# Altium schematic sheet button_brightness_esp32.SchDoc
size A4
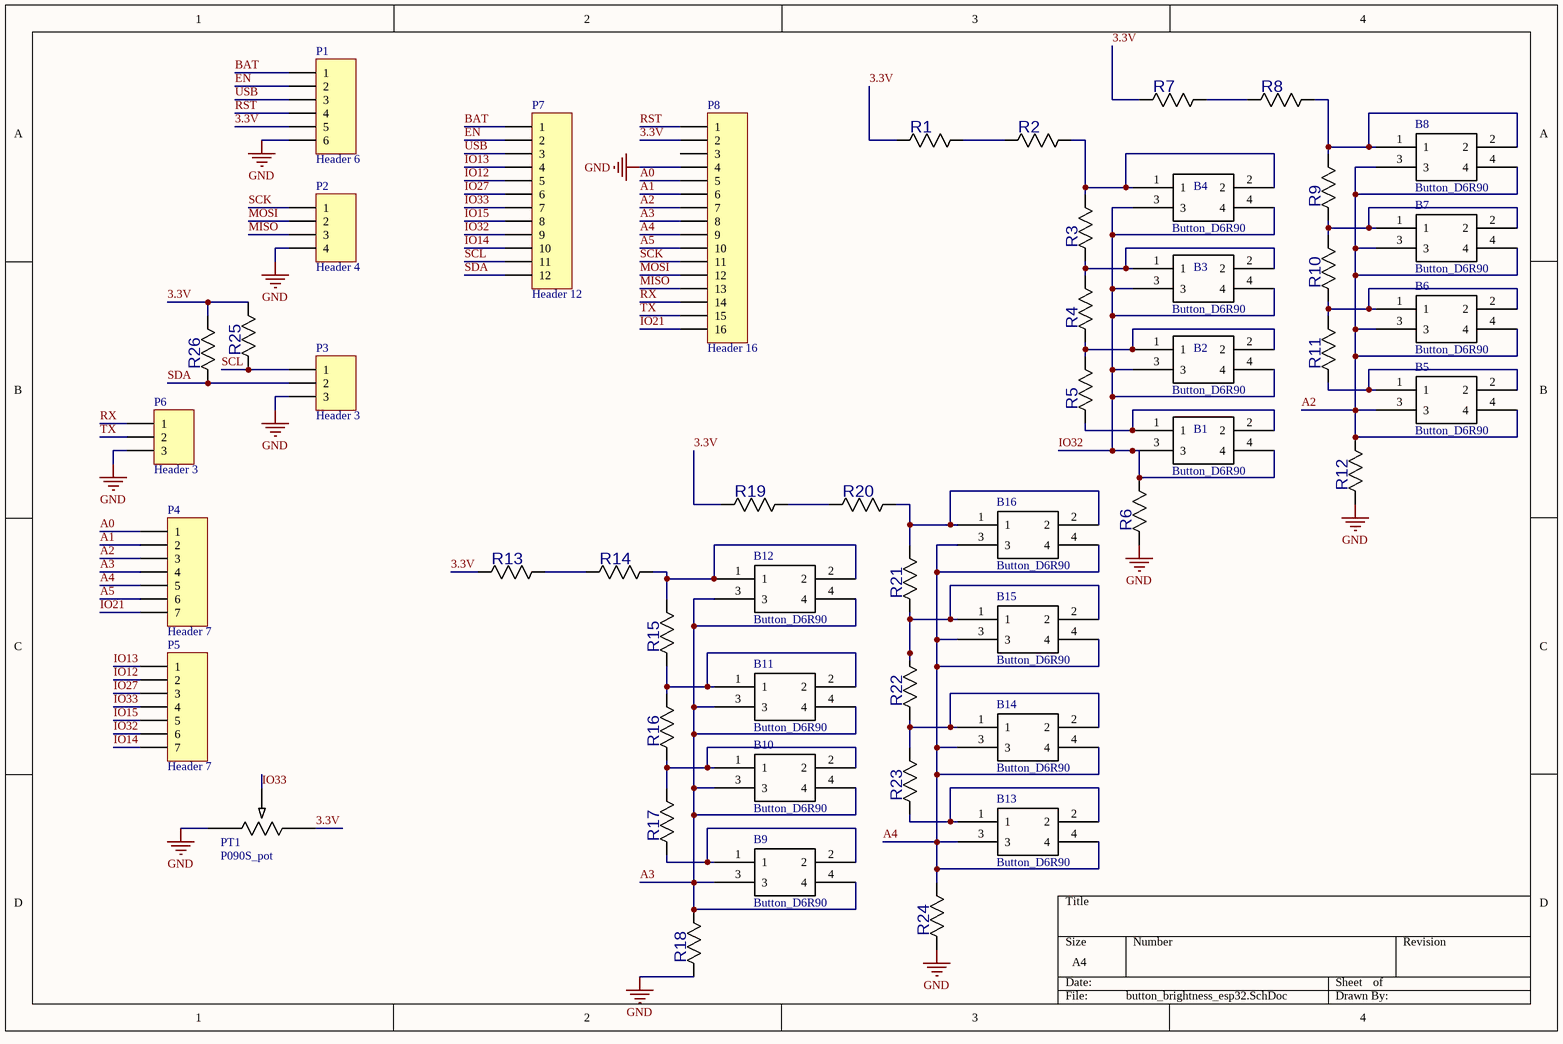
[diagram p0: button_brightness_esp32.SchDoc]

## Parts
B1  Button_D6R90  [Button_D6R90]
B2  Button_D6R90  [Button_D6R90]
B3  Button_D6R90  [Button_D6R90]
B4  Button_D6R90  [Button_D6R90]
B5  Button_D6R90  [Button_D6R90]
B6  Button_D6R90  [Button_D6R90]
B7  Button_D6R90  [Button_D6R90]
B8  Button_D6R90  [Button_D6R90]
B9  Button_D6R90  [Button_D6R90]
B10  Button_D6R90  [Button_D6R90]
B11  Button_D6R90  [Button_D6R90]
B12  Button_D6R90  [Button_D6R90]
B13  Button_D6R90  [Button_D6R90]
B14  Button_D6R90  [Button_D6R90]
B15  Button_D6R90  [Button_D6R90]
B16  Button_D6R90  [Button_D6R90]
P1  Header 6  [CONN_6]
P2  Header 4  [CONN_4]
P3  Header 3  [CONN_3]
P4  Header 7  [CONN_7]
P5  Header 7  [CONN_7]
P6  Header 3  [CONN_3]
P7  Header 12  [ESP32_feather_short_pins]
P8  Header 16  [ESP32_feather_long_pins]
PT1  P090S_pot  [POT_PTA3043]
R1  ERJ-6GEYJ471V  [RES_0804_panasonic]  (value not drawn)
R2  ERJ-6GEYJ471V  [RES_0804_panasonic]  (value not drawn)
R3  ERJ-6GEYJ471V  [RES_0804_panasonic]  (value not drawn)
R4  ERJ-6GEYJ471V  [RES_0804_panasonic]  (value not drawn)
R5  ERJ-6GEYJ471V  [RES_0804_panasonic]  (value not drawn)
R6  ERJ-6GEYJ471V  [RES_0804_panasonic]  (value not drawn)
R7  ERJ-6GEYJ471V  [RES_0804_panasonic]  (value not drawn)
R8  ERJ-6GEYJ471V  [RES_0804_panasonic]  (value not drawn)
R9  ERJ-6GEYJ471V  [RES_0804_panasonic]  (value not drawn)
R10  ERJ-6GEYJ471V  [RES_0804_panasonic]  (value not drawn)
R11  ERJ-6GEYJ471V  [RES_0804_panasonic]  (value not drawn)
R12  ERJ-6GEYJ471V  [RES_0804_panasonic]  (value not drawn)
R13  ERJ-6GEYJ471V  [RES_0804_panasonic]  (value not drawn)
R14  ERJ-6GEYJ471V  [RES_0804_panasonic]  (value not drawn)
R15  ERJ-6GEYJ471V  [RES_0804_panasonic]  (value not drawn)
R16  ERJ-6GEYJ471V  [RES_0804_panasonic]  (value not drawn)
R17  ERJ-6GEYJ471V  [RES_0804_panasonic]  (value not drawn)
R18  ERJ-6GEYJ471V  [RES_0804_panasonic]  (value not drawn)
R19  ERJ-6GEYJ471V  [RES_0804_panasonic]  (value not drawn)
R20  ERJ-6GEYJ471V  [RES_0804_panasonic]  (value not drawn)
R21  ERJ-6GEYJ471V  [RES_0804_panasonic]  (value not drawn)
R22  ERJ-6GEYJ471V  [RES_0804_panasonic]  (value not drawn)
R23  ERJ-6GEYJ471V  [RES_0804_panasonic]  (value not drawn)
R24  ERJ-6GEYJ471V  [RES_0804_panasonic]  (value not drawn)
R25  ERJ-6GEYJ471V  [RES_0804_panasonic]  (value not drawn)
R26  ERJ-6GEYJ471V  [RES_0804_panasonic]  (value not drawn)

## Nets
GND: P1.6 P2.4 P3.3 P6.3 P8.4 PT1.1 R6.2 R12.2 R18.2 R24.2
3.3V: P1.5 P8.2 PT1.3 R1.2 R7.2 R13.2 R19.2 R25.1 R26.1
A0: P4.1 P8.5
A1: P4.2 P8.6
A2: B5.3 B5.4 B6.3 B6.4 B7.3 B7.4 B8.3 B8.4 P4.3 P8.7 R12.1
A3: B9.3 B9.4 B10.3 B10.4 B11.3 B11.4 B12.3 B12.4 P4.4 P8.8 R18.1
A4: B13.3 B13.4 B14.3 B14.4 B15.3 B15.4 B16.3 B16.4 P4.5 P8.9 R24.1
A5: P4.6 P8.10
BAT: P1.1 P7.1
EN: P1.2 P7.2
IO12: P5.2 P7.5
IO13: P5.1 P7.4
IO14: P5.7 P7.10
IO15: P5.5 P7.8
IO21: P4.7 P8.16
IO27: P5.3 P7.6
IO32: B1.3 B1.4 B2.3 B2.4 B3.3 B3.4 B4.3 B4.4 P5.6 P7.9 R6.1
IO33: P5.4 P7.7 PT1.2
MISO: P2.3 P8.13
MOSI: P2.2 P8.12
RST: P1.4 P8.1
RX: P6.1 P8.14
SCK: P2.1 P8.11
SCL: P3.1 P7.11 R25.2
SDA: P3.2 P7.12 R26.2
TX: P6.2 P8.15
USB: P1.3 P7.3
NetB1_1: B1.1 B1.2 R5.2
NetB2_1: B2.1 B2.2 R4.2 R5.1
NetB3_1: B3.1 B3.2 R3.2 R4.1
NetB4_1: B4.1 B4.2 R2.1 R3.1
NetB5_1: B5.1 B5.2 R11.2
NetB6_1: B6.1 B6.2 R10.2 R11.1
NetB7_1: B7.1 B7.2 R9.2 R10.1
NetB8_1: B8.1 B8.2 R8.1 R9.1
NetB9_1: B9.1 B9.2 R17.2
NetB10_1: B10.1 B10.2 R16.2 R17.1
NetB11_1: B11.1 B11.2 R15.2 R16.1
NetB12_1: B12.1 B12.2 R14.1 R15.1
NetB13_1: B13.1 B13.2 R23.2
NetB14_1: B14.1 B14.2 R22.2 R23.1
NetB15_1: B15.1 B15.2 R21.2 R22.1
NetB16_1: B16.1 B16.2 R20.1 R21.1
NetR1_1: R1.1 R2.2
NetR7_1: R7.1 R8.2
NetR13_1: R13.1 R14.2
NetR19_1: R19.1 R20.2

Not connected (* = marked no-connect by the designer): P8 3

## Library data of the parts
P1 = Header 6: Header, 6-Pin; LatestRevisionDate: 17-Jul-2002; LatestRevisionNote: Re-released for DXP Platform.; Publisher: Altium Limited
P2 = Header 4: Header, 4-Pin; LatestRevisionDate: 17-Jul-2002; LatestRevisionNote: Re-released for DXP Platform.; Publisher: Altium Limited
P3 P6 = Header 3: Header, 3-Pin; LatestRevisionDate: 17-Jul-2002; LatestRevisionNote: Re-released for DXP Platform.; Publisher: Altium Limited
P4 P5 = Header 7: Header, 7-Pin; LatestRevisionDate: 17-Jul-2002; LatestRevisionNote: Re-released for DXP Platform.; Publisher: Altium Limited
P7 = Header 12: Header, 12-Pin; LatestRevisionDate: 17-Jul-2002; LatestRevisionNote: Re-released for DXP Platform.; Publisher: Altium Limited
P8 = Header 16: Header, 16-Pin; LatestRevisionDate: 17-Jul-2002; LatestRevisionNote: Re-released for DXP Platform.; Publisher: Altium Limited
R1-R26 = ERJ-6GEYJ471V: C: Copyright (C) 2015 Accelerated Designs. All rights reserved; Vendor: Panasonic; Built_By: EMA_UL_Team; Manufacturer_Part_Number: ERJ-6GEYJ471V